# EAGLE design U (EAGLE 9.6.2)
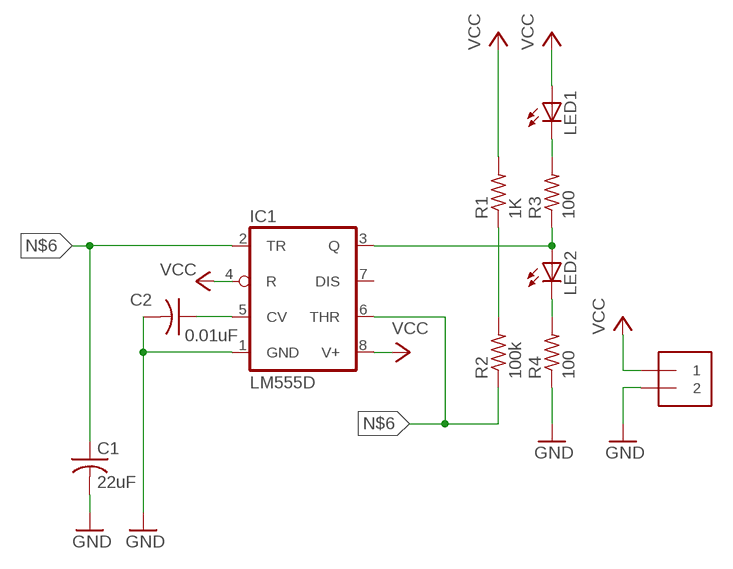
[diagram p0: schematic, sheet 1]

## Parts
C1  22uF  C-USC0805  [C0805]
C2  0.01uF  C-USC0805  [C0805]
IC1  LM555D  [SO08]
J1  1X2-3.5MM  [1X2-3.5MM]
LED1  LEDCHIPLED_0805  [CHIPLED_0805]
LED2  LEDCHIPLED_0805  [CHIPLED_0805]
R1  1K  R-US_R0805  [R0805]
R2  100k  R-US_R0805  [R0805]
R3  100  R-US_R0805  [R0805]
R4  100  R-US_R0805  [R0805]

## Nets
GND: C1.2 C2.2 IC1.1(GND) J1.2 R4.1
N$1: LED1.C R3.2
N$2: IC1.3(Q) LED2.A R3.1
N$3: LED2.C R4.2
N$4: R1.1 R2.2
N$6: C1.1 IC1.2(TR) IC1.6(THR) R2.1
N$7: C2.1 IC1.5(CV)
VCC: IC1.4(R) IC1.8(V+) J1.1 LED1.A R1.2
Unconnected: IC1.7(DIS)

## Library data of the parts
C1 C2 = adafruit:C-US: CAPACITOR, American symbol
IC1 = adafruit:*555: TIMER Changed DIP package to have round (not oval) pin pads http://www.ladyada.net/library/pcb/eaglelibrary.html
J1 = adafruit:1X2: 3.5mm Terminal block http://www.ladyada.net/library/pcb/eaglelibrary.html
LED1 LED2 = adafruit:LED: LED OSRAM: - CHIPLED LG R971, LG N971, LY N971, LG Q971, LY Q971, LO R971, LY R971 LH N974, LH R974 LS Q976, LO Q976, LY Q976 LO Q996 - Hyper CHIPLED LW Q18S LB Q993, LB Q99A, LB R99A - SideLED LS A670, LO A670, LY A670, LG A670, LP A670 LB A673, LV A673, LT A673, LW A673 LH A674 LY A675 LS A676, LA A676, LO A676, LY A676, LW A676 LS A679, LY A679, LG A679 - Hyper Micro SIDELED® LS Y876, LA Y876, LO Y876, LY Y876 LT Y87S - SmartLED LW L88C, LW L88S LB L89C, LB L89S, LG L890 LS L89K, LO L89K, LY L89K LS L896, LA L896, LO L896, LY L896 - TOPLED LS T670, LO T670, LY T670, LG T670, LP T670 LSG T670, LSP T670, LSY T670, LOP T670, LYG T670 LG T671, LOG T671, LSG T671 LB T673, LV T673, LT T673, LW T673 LH T674 LS T676, LA T676, LO T676, LY T676, LB T676, LH T676, LSB T676, LW T676 LB T67C, LV T67C, LT T67C, LS T67K, LO T67K, LY T67K, LW E67C LS E67B, LA E67B, LO E67B, LY E67B, LB E67C, LV E67C, LT E67C LW T67C LS T679, LY T679, LG T679 LS T770, LO T770, LY T770, LG T770, LP T770 LB T773, LV T773, LT T773, LW T773 LH T774 LS E675, LA E675, LY E675, LS T675 LS T776, LA T776, LO T776, LY T776, LB T776 LHGB T686 LT T68C, LB T68C - Hyper Mini TOPLED® LB M676 - Mini TOPLED Santana® LG M470 LS M47K, LO M47K, LY M47K Source: http://www.osram.convergy.de/
R1-R4 = adafruit:R-US_: RESISTOR, American symbol

## Board
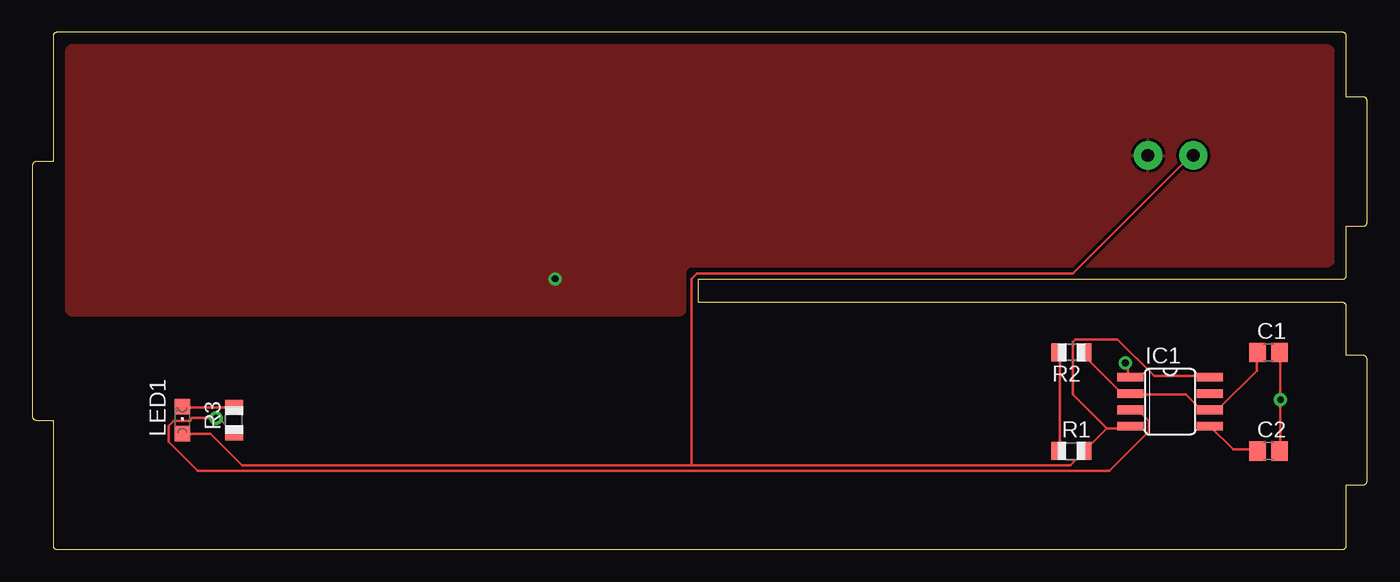
[diagram p1: board, top side]
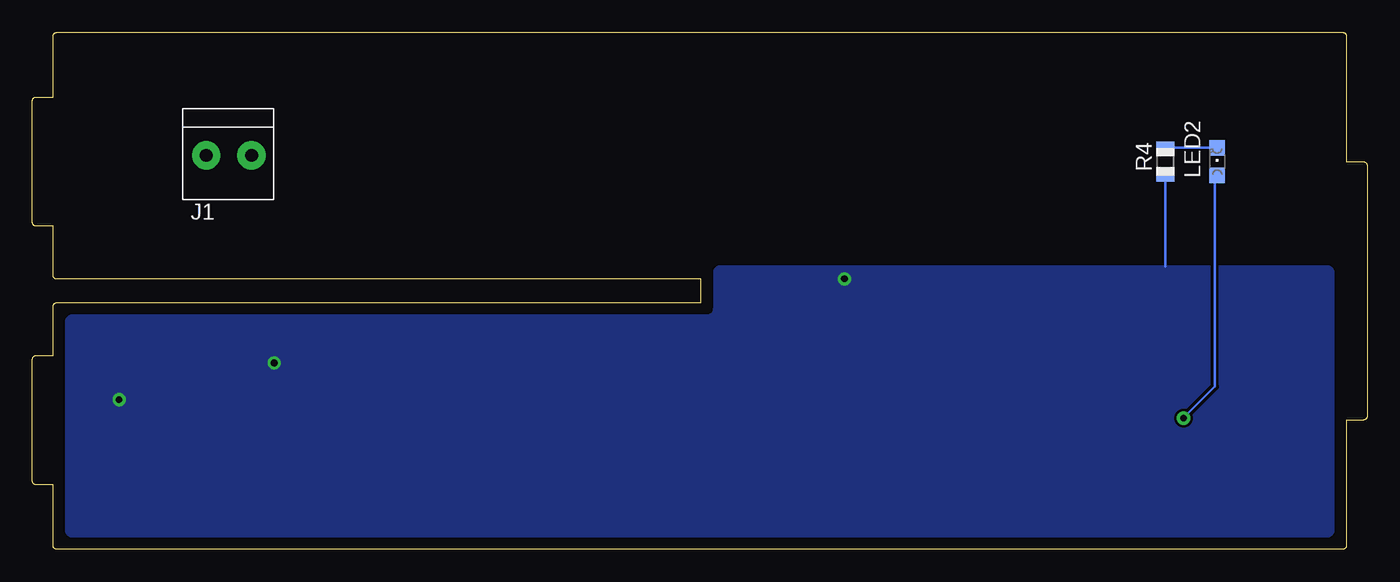
[diagram p2: board, bottom side, seen from below]

Size 103.2 x 40 mm. Coordinates in mm from the lower left corner, seen from the top.
Outline: 1.6,10 1.6,0.32 arc90 1.92,0 101.28,0 arc90 101.6,0.32 101.6,5 102.88,5 arc90 103.2,5.32 103.2,14.68 arc90 102.88,15 101.6,15 101.6,18.78 arc90 101.28,19.1 51.5,19.1 51.5,20.9 101.28,20.9 arc90 101.6,21.22 101.6,25 102.88,25 arc90 103.2,25.32 103.2,34.68 arc90 102.88,35 101.6,35 101.6,39.68 arc90 101.28,40 1.92,40 arc90 1.6,39.68 1.6,30 0.32,30 arc90 0,29.68 0,10.32 arc90 0.32,10 1.6,10
Copper layers (1*16): Top 0.035mm / dielectric 1.5mm / Bottom 0.035mm
Design rules "SparkFun": minimum track width 8mil, minimum drill 20mil, track to track 8mil, track to pad 8mil, pad to pad 8mil, via to via 8mil, smd to smd 8mil, copper to edge 10mil, drill to drill 8mil, minimum pad ring 12mil, minimum via ring 10mil, stop-mask expansion 4mil, vias tented up to drill 25mil, thermal gap 10mil

### Footprints (pad centres in the part's own frame; a part is rotated, then mirrored left to right if it is on the bottom)
C0805 = smd 1.3 x 1.5: 1 -0.85,0; 2 0.85,0
SO08 = smd 0.66 x 2.032: 1 -1.905,-3.073; 2 -0.635,-3.073; 3 0.635,-3.073; 4 1.905,-3.073; 5 1.905,3.073; 6 0.635,3.073; 7 -0.635,3.073; 8 -1.905,3.073
1X2-3.5MM = drill 1 pad 2.184: 1 1.8,0; 2 -1.7,0
CHIPLED_0805 = smd 1.2 x 1.2: A 0,-1.05; C 0,1.05
R0805 = smd 1.1 x 1.4: 1 -1,0; 2 1,0

### Placement (x,y rotation side)
C1  95.58,15.24 0 top
C2  95.58,7.62 0 top
IC1  87.96,11.43 270 top
J1  87.96,30.48 180 bottom
LED1  11.6,10 0 top
LED2  11.6,30 0 bottom
R1  80.34,7.62 0 top
R2  80.34,15.24 180 top
R3  15.6,10 90 top
R4  15.6,30 90 bottom

### Tracks (layer width: path | path; a pad name or v marks a point on that pad's centre or on a via)
GND  (via drill 0.51)
  Top 0.203: C2.2 96.49,7.72 v96.49,11.58 96.49,15.24 C1.2 | v84.51,14.43 84.71,14.22 84.71,13.41 IC1.1
  Bottom 0.203: R4.1 15.62,28.85 15.62,21.9
  other vias: 40.41,20.93
  pour Bottom: 51,18.1 100.1,18.1 arc-90 100.6,17.6 100.6,1.5 arc-90 100.1,1 3.1,1 arc-90 2.6,1.5 2.6,21.4 arc-90 3.1,21.9 50,21.9 arc-90 50.5,21.4 50.5,18.6 arc90
  pour Top: 51,21.9 100.1,21.9 arc90 100.6,22.4 100.6,38.5 arc90 100.1,39 3.1,39 arc90 2.6,38.5 2.6,18.6 arc90 3.1,18.1 50,18.1 arc90 50.5,18.6 50.5,21.4 arc-90
N$1
  Top 0.203: LED1.C 11.76,10.97 15.42,10.97 R3.2
N$2  (via drill 0.51)
  Top 0.203: R3.1 15.42,9.14 14.4,10.16 v14.2,10.16 12.37,10.16 12.17,9.96 10.95,9.96 10.54,9.55 10.54,8.33 12.78,6.1 83.29,6.1 86.33,9.14 86.33,9.96 85.52,10.77 84.91,10.77 IC1.3
  Bottom 0.203: v14.2,10.16 11.76,12.6 11.76,28.85 LED2.A
N$3
  Bottom 0.203: LED2.C 11.76,31.09 15.42,31.09 R4.2
N$4
  Top 0.203: R1.1 79.43,7.72 79.43,15.24 R2.2
N$6
  Top 0.203: R2.1 81.46,15.24 81.46,14.83 84.1,12.19 84.71,12.19 IC1.2 84.91,11.99 89.18,11.99 90.19,10.97 91.01,10.97 IC1.6 91.21,10.97 91.82,10.97 94.67,13.82 94.67,15.24 C1.1
N$7
  Top 0.203: IC1.5 92.84,7.72 94.67,7.72 C2.1
VCC
  Top 0.203: 50.98,6.5 80.24,6.5 81.25,7.52 R1.2 81.46,7.72 83.08,9.35 | 50.98,6.5 16.23,6.5 13.79,8.94 11.76,8.94 LED1.A | 83.08,9.35 84.71,9.35 IC1.4 | 83.08,9.35 80.44,11.99 80.44,16.05 80.64,16.26 83.9,16.26 86.74,13.41 91.01,13.41 IC1.8 | 50.98,6.5 50.98,20.93 51.38,21.34 80.44,21.34 89.59,30.48 J1.1